# EAGLE design PowerDeliveryBoard (EAGLE 9.5.1)
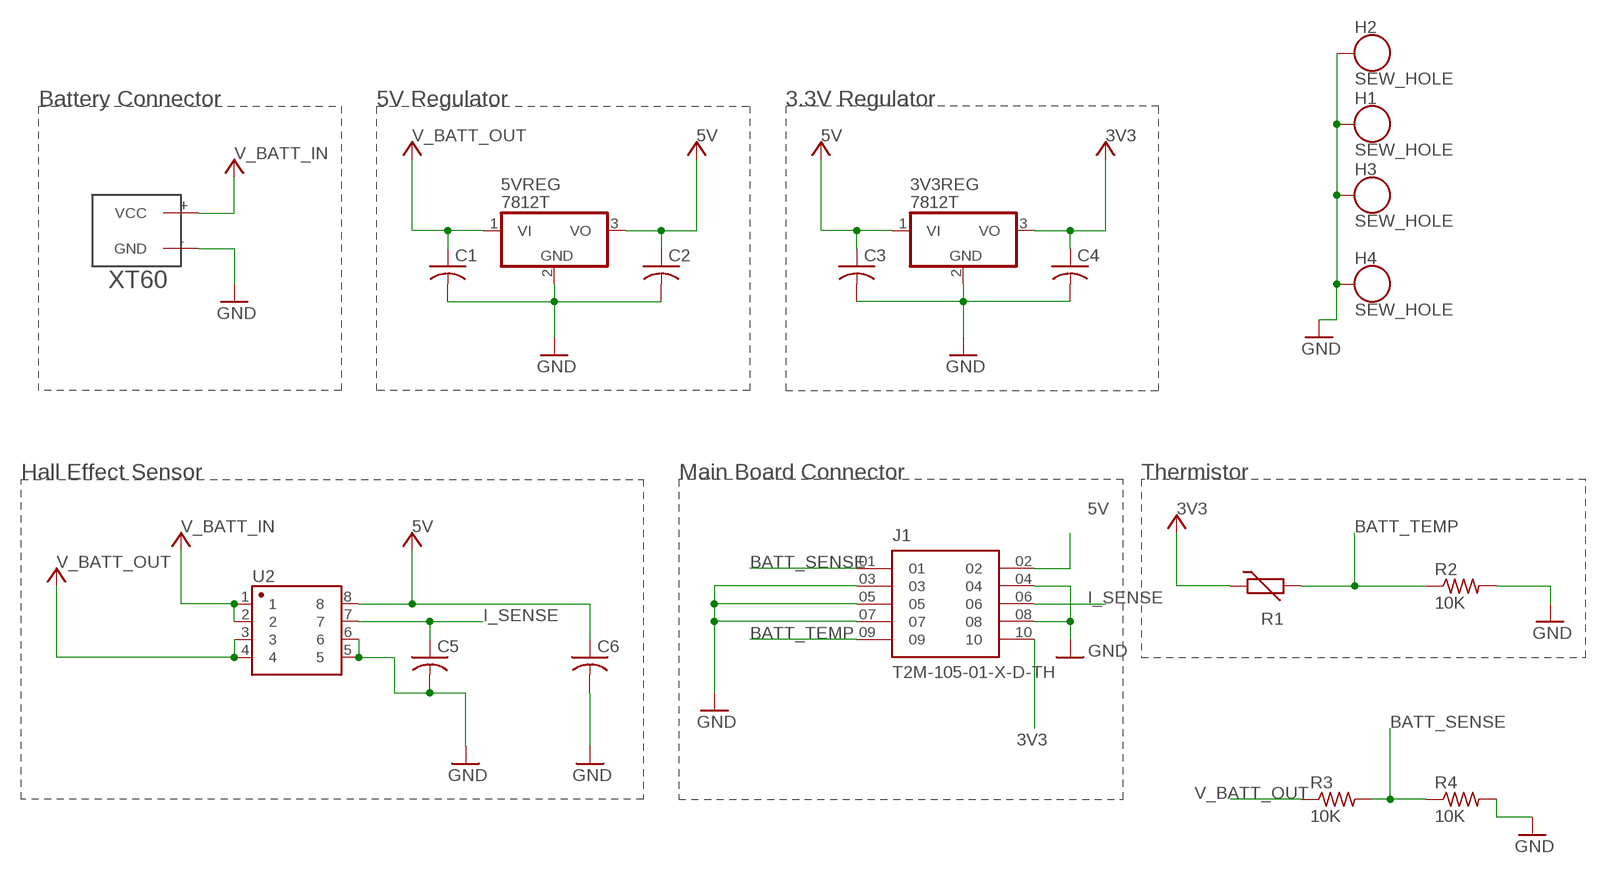
[diagram p0: schematic, sheet 1]

## Parts
3V3REG  7812T  [TO220H]
5VREG  7812T  [TO220H]
C1  C-USC0805  [C0805]
C2  C-USC0805  [C0805]
C3  C-USC0805  [C0805]
C4  C-USC0805  [C0805]
C5  C-USC0805  [C0805]
C6  C-USC0805  [C0805]
H1  SEW_HOLE  [SIMPLE_HOLE]
H2  SEW_HOLE  [SIMPLE_HOLE]
H3  SEW_HOLE  [SIMPLE_HOLE]
H4  SEW_HOLE  [SIMPLE_HOLE]
J1  T2M-105-01-X-D-TH  [SAMTEC_T2M-105-01-X-D-TH]
R1  THERMISTOR-5  [R-5]
R2  10K  R-US_R0805  [R0805]
R3  10K  R-US_R0805  [R0805]
R4  10K  R-US_R0805  [R0805]
U2  ASC723  GENERIC-SOIC8MSGEQ7N-FILTER  [SO08]
U$3  XT60_XT60  [XT60_XT60]

## Nets
3V3: 3V3REG.3(VO) C4.1 J1.10 R1.1 ; supply symbol labelled VCC
5V: 3V3REG.1(VI) 5VREG.3(VO) C2.1 C3.1 C6.1 J1.02 U2.8 ; supply symbol labelled VCC
BATT_SENSE: J1.01 R3.2 R4.1
BATT_TEMP: J1.09 R1.2 R2.1
GND: 3V3REG.2(GND) 5VREG.2(GND) C1.2 C2.2 C3.2 C4.2 C5.2 C6.2 H1.P$1 H2.P$1 H3.P$1 H4.P$1 J1.03 J1.04 J1.05 J1.07 J1.08 R2.2 R4.2 U2.5 U2.6 U$3.-(GND)
I_SENSE: C5.1 J1.06 U2.7
V_BATT_IN: U2.1 U2.2 U$3.+(VCC) ; supply symbol labelled VCC
V_BATT_OUT: 5VREG.1(VI) C1.1 R3.1 U2.3 U2.4 ; supply symbol labelled VCC

## Notes on the sheet
- Battery Connector | 5V Regulator | 3.3V Regulator
- Hall Effect Sensor | Main Board Connector | Thermistor

## Library data of the parts
3V3REG 5VREG = adafruit(seeIMUBreakout):78*: Positive VOLTAGE REGULATOR Added bigger pads to the TO-92 package
C1-C6 = adafruit(seeIMUBreakout):C-US: CAPACITOR, American symbol
H1-H4 = SparkFun-Retired:SEW_HOLE: SparkFun LilyPad Sew Hole Simple sew-tap with .1" diameter hole with 20mil annular ring SparkFun Products: [PRODUCT 1] <[PRODUCT1LINK]> [PRODUCT 2] <PRODUCT2LINK> [PRODUCT 3] <PRODUCT3LINK>
J1 = T2M-105-01-X-D-TH:T2M-105-01-X-D-TH; MANUFACTURER: Samtec; MAXIMUM_PACKAGE_HEIGHT: 6.55mm; PARTREV: AH; STANDARD: Manufacturer Recommendations
R1 = varistor:THERMISTOR: THERMISTOR
R2-R4 = adafruit(seeIMUBreakout):R-US_: RESISTOR, American symbol
U2 = SparkFun-Retired:GENERIC-SOIC8: A placeholder for generic narrow & wide SOIC8 foorptints - used on the DIP adapter board. Has strange reference to IC-10141, a Seven Band Graphic Equalizer Display Filter SOIC-8 VFP: IC-10141; PROD_ID: IC-10141
U$3 = XT60_LipoConnector:XT60_XT60: XT60

## Board
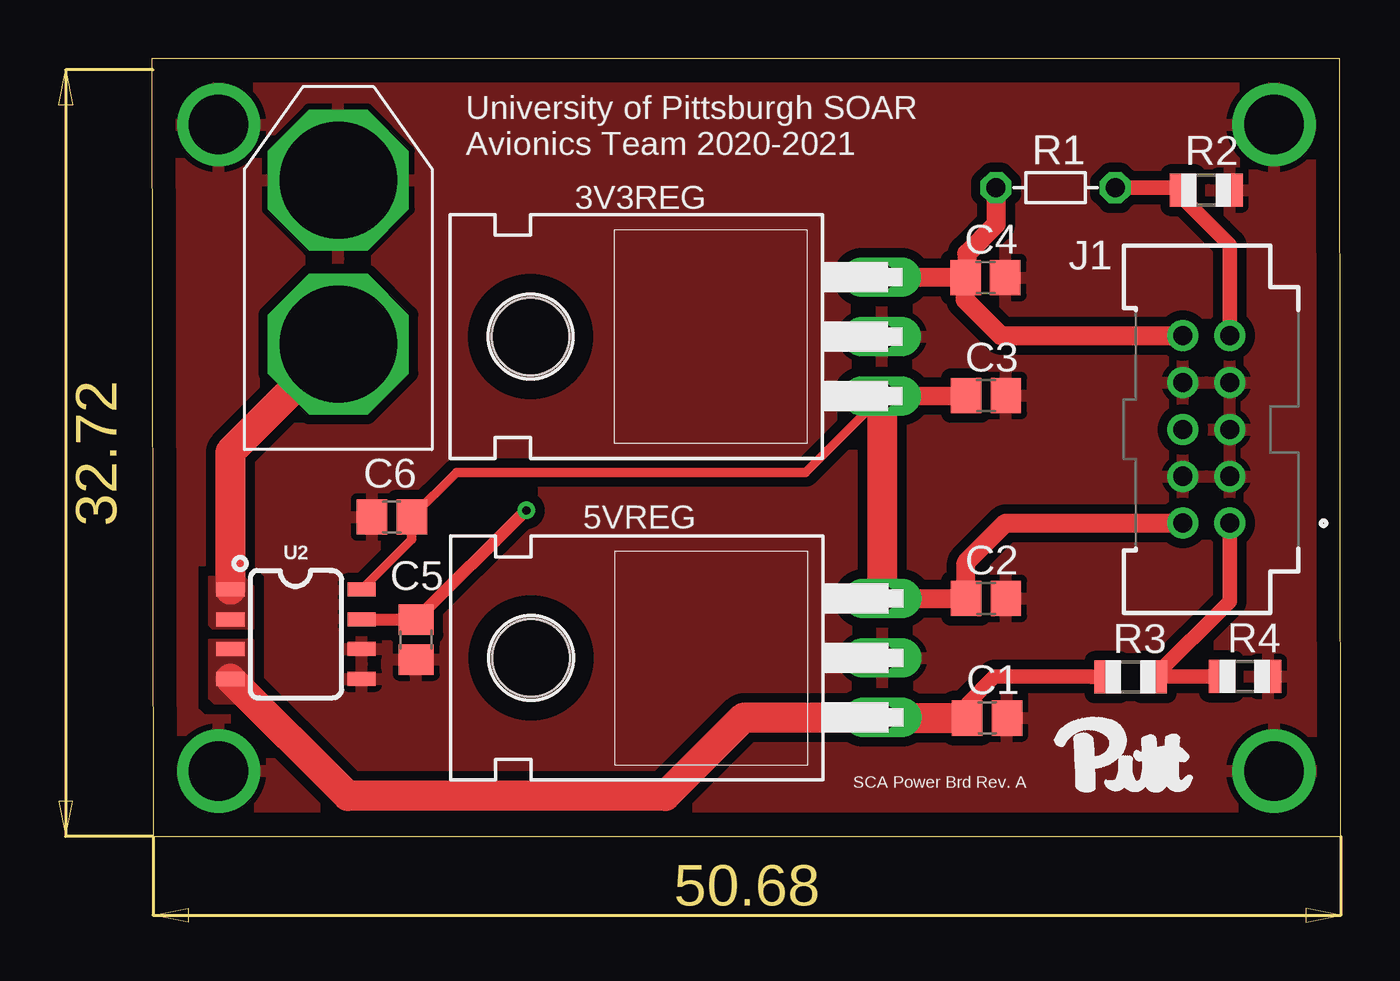
[diagram p1: board, top side]
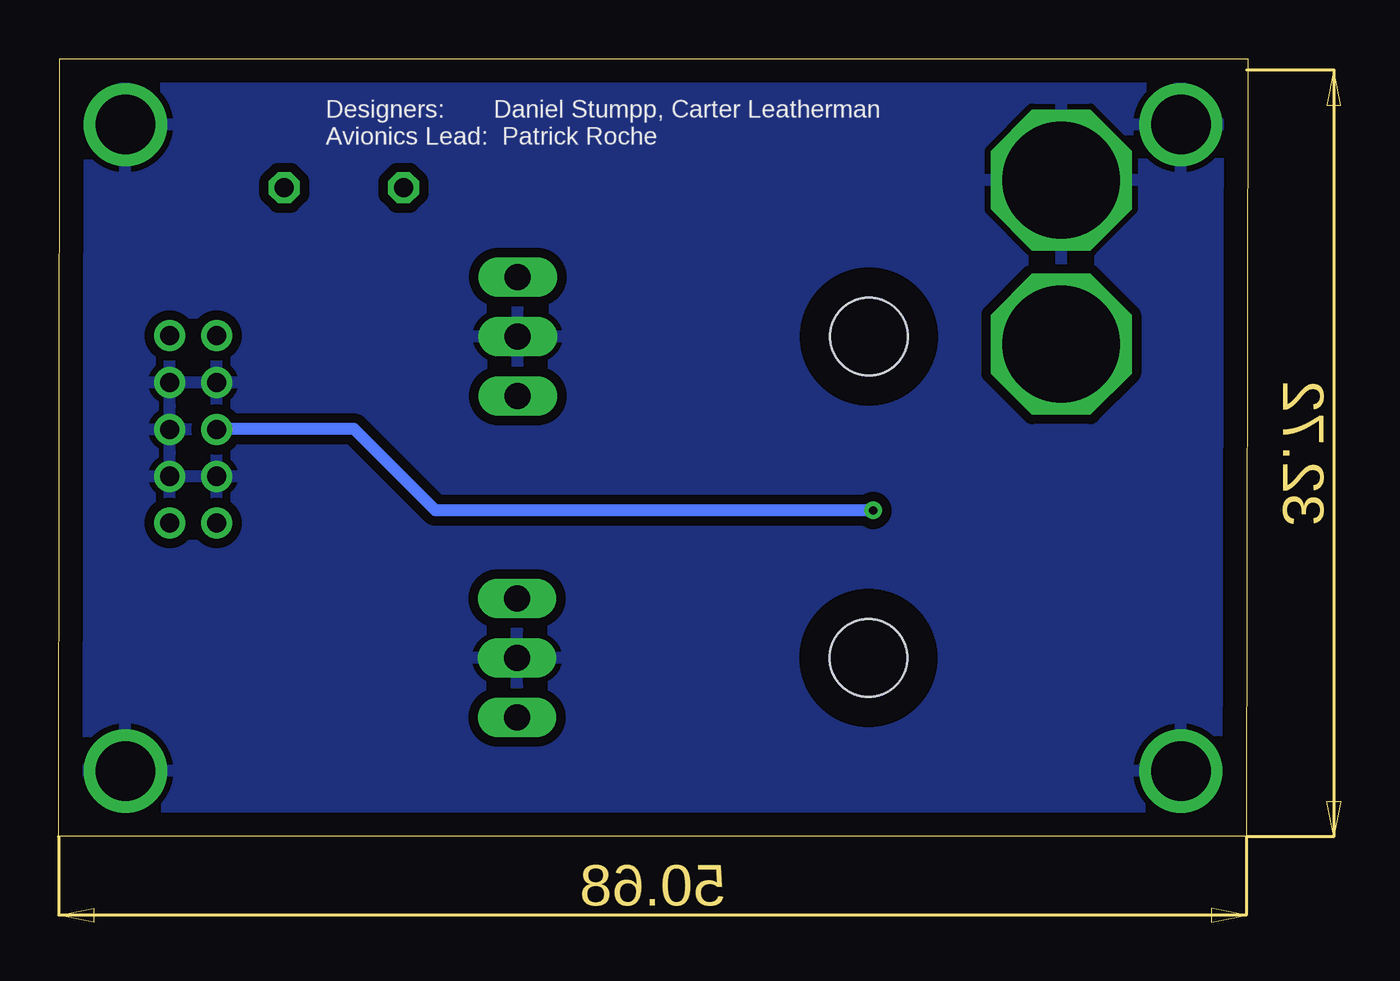
[diagram p2: board, bottom side, seen from below]

Size 50.73 x 33.2 mm. Coordinates in mm from the lower left corner, seen from the top.
Outline: 0.05,0 50.73,0 50.68,33.2 0,33.2 0.05,0
Copper layers (1*16): Top 0.035mm / dielectric 1.5mm / Bottom 0.035mm
Design rules "default": minimum track width 6mil, minimum drill 0.35mm, track to track 6mil, track to pad 6mil, pad to pad 6mil, via to via 6mil, smd to smd 6mil, copper to edge 40mil, drill to drill 6mil, minimum pad ring 10mil, minimum via ring 8mil, stop-mask expansion 4mil, vias tented up to drill 0mil, thermal gap 10mil

### Footprints (pad centres in the part's own frame; a part is rotated, then mirrored left to right if it is on the bottom)
TO220H = drill 1.118 long: 1 -2.54,-10.16; 2 0,-10.16; 3 2.54,-10.16 | hole 3.302: 0,4.826
C0805 = smd 1.3 x 1.5: 1 -0.85,0; 2 0.85,0
SIMPLE_HOLE = drill 2.54 pad 3.048: P$1 0,0
SAMTEC_T2M-105-01-X-D-TH = drill 0.813 pad 1.163: 01 -4,-1; 02 -4,1; 03 -2,-1; 04 -2,1; 05 0,-1; 06 0,1; 07 2,-1; 08 2,1; 09 4,-1; 10 4,1
R-5 = drill 0.813 octagon: 1 -2.54,0; 2 2.54,0
R0805 = smd 1.1 x 1.4: 1 -1,0; 2 1,0
SO08 = smd 0.6 x 1.2: 1 -1.905,-2.8; 2 -0.635,-2.8; 3 0.635,-2.8; 4 1.905,-2.8; 5 1.905,2.8; 6 0.635,2.8; 7 -0.635,2.8; 8 -1.905,2.8
XT60_XT60 = drill 5 octagon: + 4.5,0; - 11.5,0

### Placement (x,y rotation side)
3V3REG  20.98,21.34 90 top
5VREG  21.01,7.62 90 top
C1  35.64,5.05 0 top
C2  35.59,10.16 0 top
C3  35.59,18.82 0 top
C4  35.56,23.85 0 top
C5  11.28,8.41 270 top
C6  10.24,13.64 180 top
H1  47.88,2.79 0 top
H2  47.88,30.38 0 top
H3  2.85,30.38 0 top
H4  2.85,2.79 0 top
J1  44.98,17.37 90 top
R1  38.56,27.69 0 top
R2  44.98,27.58 0 top
R3  41.76,6.81 0 top
R4  46.63,6.83 0 top
U2  6.15,8.64 270 top
U$3  7.95,16.51 90 top

### Tracks (layer width: path | path; a pad name or v marks a point on that pad's centre or on a via)
3V3
  Top 0.61: C4.1 34.69,23.83
  Top 0.813: 3V3REG.3 34.69,23.88 C4.1 34.77,23.91 34.77,24.88 36.02,26.13 R1.1 | 34.69,23.83 34.69,22.91 36.23,21.37 J1.10
5V
  Top 0.406: U2.8 11.09,12.68 C6.1 12.99,15.54 27.89,15.54 3V3REG.1 31.17,18.77
  Top 0.813: 5VREG.3 C2.1 34.74,11.69 36.42,13.37 J1.02 | 3V3REG.1 C3.1
  Top 1.27: 5VREG.3 31.17,18.77
BATT_SENSE
  Top 0.61: R4.1 42.78,6.83 R3.2 45.98,10.03 J1.01
BATT_TEMP
  Top 0.61: R1.2 43.88,27.69 R2.1 43.98,27.24 45.98,25.24 J1.09
GND
  pour Top (isolate 0.406, rank 2): 0.18,33.15 50.72,33.15 50.72,0.25 50.47,0 0.18,0 0.05,0.13 0.05,33.15
  pour Bottom (isolate 0.406): -0.08,33.15 50.85,33.15 50.98,33.02 50.98,0 50.85,-0.13 0.05,-0.13 0.05,33.02
I_SENSE  (via drill 0.35)
  Top 0.508: U2.7 11.26,9.27 C5.1 15.94,13.92 v15.98,13.92
  Bottom 0.508: v15.98,13.92 34.65,13.92 38.13,17.4 43.96,17.4 J1.06
V_BATT_IN
  Top 1.27: U$3.+ 3.35,16.41 U2.1
  pour Top (isolate 0.305, no thermals): 2.54,8.92 2.57,8.89 4.34,8.89 4.34,10.67 3.94,11.07 2.41,11.07 2.41,9.04 2.51,8.94
V_BATT_OUT
  Top 0.61: R3.1 40.07,6.81 40.05,6.83 35.96,6.83 34.79,5.66 C1.1
  Top 1.27: U2.4 8.35,1.73 21.89,1.73 25.25,5.08 5VREG.1 31.19,5.05 C1.1
  pour Top (no thermals): 2.44,8.41 4.29,8.41 4.32,8.38 4.32,6.27 3.71,5.66 2.67,5.66 2.44,5.89

### Text on the board
tPlace: University of Pittsburgh SOAR / Avionics Team 2020-2021 | SCA Power Brd Rev. A
bNames: Designers: Daniel Stumpp, Carter Leatherman / Avionics Lead: Patrick Roche
200bmp: C:/Users/dstum/Downloads/pitt.bmp